# Altium schematic sheet Arria10.SchDoc: ALTERA ARRIA 10 Block Diagram
size C; DocumentNumber: 17; SheetNumber: 17; SheetTotal: 46
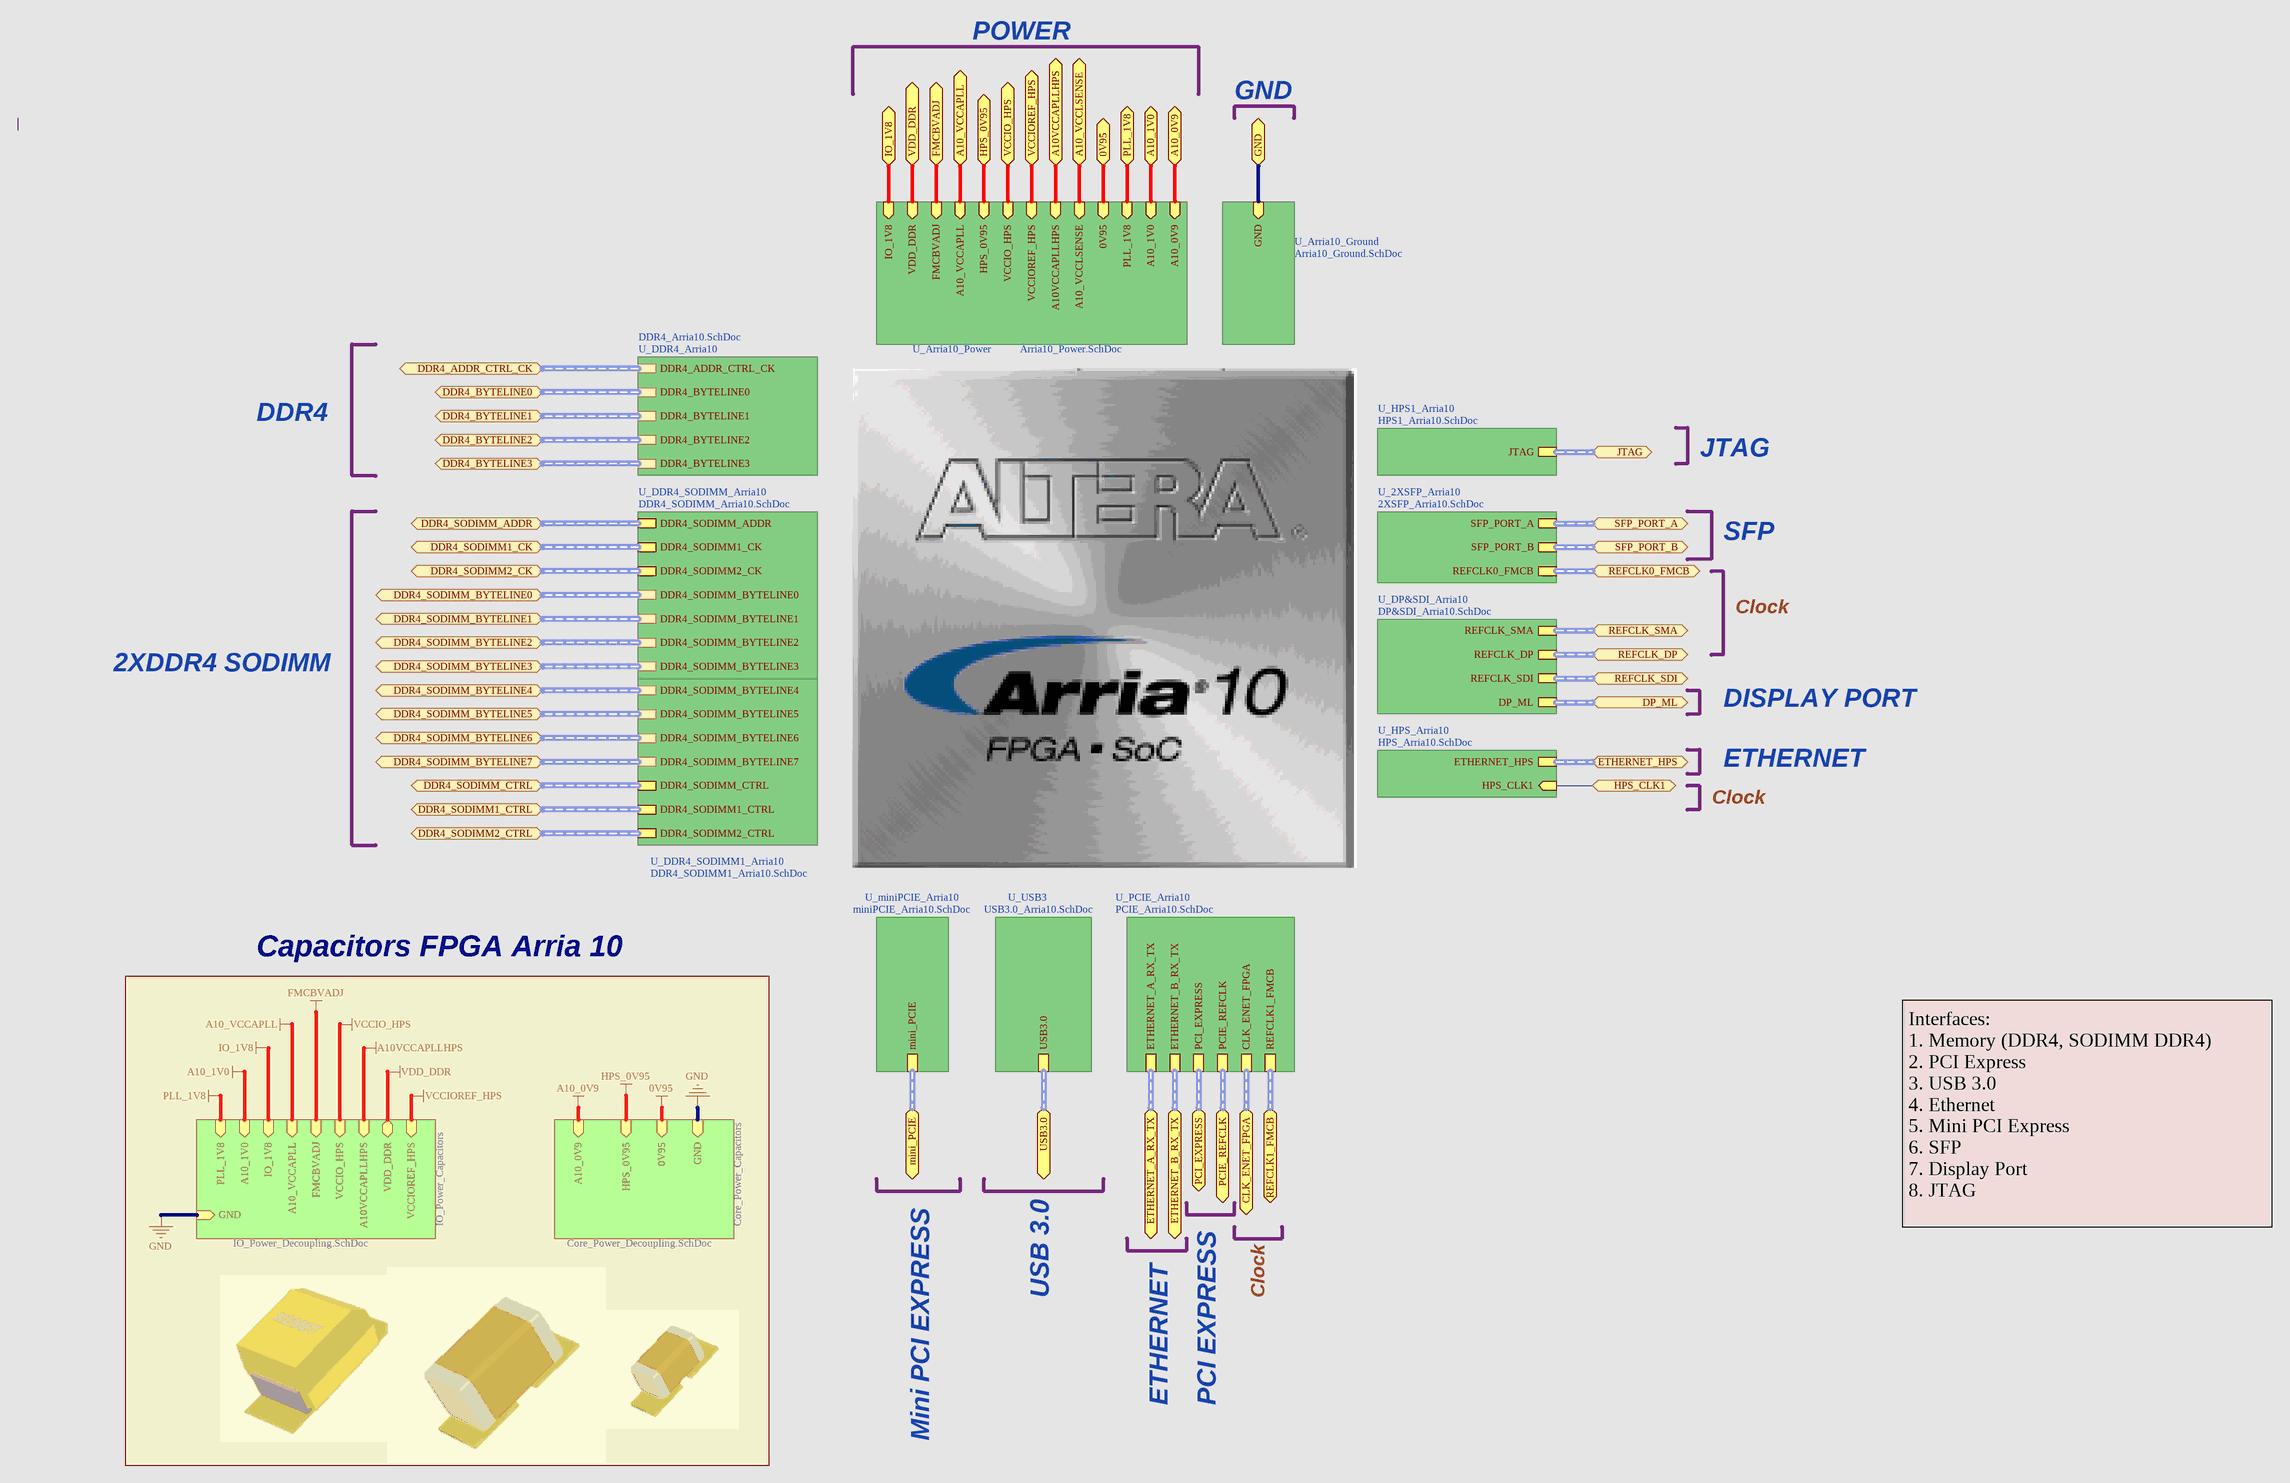
[diagram p0: Arria10.SchDoc]

## Sub-sheets
Core_Power_Capacitors = Core_Power_Decoupling.SchDoc: A10_0V9 (in), HPS_0V95 (in), 0V95 (in), GND (in)
IO_Power_Capacitors = IO_Power_Decoupling.SchDoc: PLL_1V8 (in), A10_1V0 (in), IO_1V8 (in), A10VCCAPLLHPS (in), VDD_DDR, VCCIOREF_HPS (in), A10_VCCAPLL (in), VCCIO_HPS (in), FMCBVADJ (in), GND (in)
U_2XSFP_Arria10 = 2XSFP_Arria10.SchDoc: REFCLK0_FMCB (harness REFCLK0_FMCB), SFP_PORT_B (harness SFP_PORT_B), SFP_PORT_A (harness SFP_PORT_A)
U_Arria10_Ground = Arria10_Ground.SchDoc: GND (in)
U_Arria10_Power = Arria10_Power.SchDoc: IO_1V8 (in), VDD_DDR (in), FMCBVADJ (in), A10_VCCAPLL (in), HPS_0V95 (in), VCCIO_HPS (in), VCCIOREF_HPS (in), A10VCCAPLLHPS (in), A10_VCCLSENSE (in), 0V95 (in), PLL_1V8 (in), A10_1V0 (in), A10_0V9 (in)
U_DDR4_Arria10 = DDR4_Arria10.SchDoc: DDR4_ADDR_CTRL_CK (harness DDR4_ADDR_CTRL_CK), DDR4_BYTELINE0 (harness DDR4_BYTELINE0), DDR4_BYTELINE1 (harness DDR4_BYTELINE1), DDR4_BYTELINE2 (harness DDR4_BYTELINE2), DDR4_BYTELINE3 (harness DDR4_BYTELINE3)
U_DDR4_SODIMM1_Arria10 = DDR4_SODIMM1_Arria10.SchDoc: DDR4_SODIMM1_CTRL (harness DDR4_SODIMM1_CTRL), DDR4_SODIMM2_CTRL (harness DDR4_SODIMM2_CTRL), DDR4_SODIMM_CTRL (harness DDR4_SODIMM_CTRL), DDR4_SODIMM_BYTELINE4 (harness DDR4_SODIMM_BYTELINE4), DDR4_SODIMM_BYTELINE5 (harness DDR4_SODIMM_BYTELINE5), DDR4_SODIMM_BYTELINE6 (harness DDR4_SODIMM_BYTELINE6), DDR4_SODIMM_BYTELINE7 (harness DDR4_SODIMM_BYTELINE7)
U_DDR4_SODIMM_Arria10 = DDR4_SODIMM_Arria10.SchDoc: DDR4_SODIMM_ADDR (harness DDR4_SODIMM_ADDR), DDR4_SODIMM1_CK (harness DDR4_SODIMM1_CK), DDR4_SODIMM2_CK (harness DDR4_SODIMM2_CK), DDR4_SODIMM_BYTELINE0 (harness DDR4_SODIMM_BYTELINE0), DDR4_SODIMM_BYTELINE1 (harness DDR4_SODIMM_BYTELINE1), DDR4_SODIMM_BYTELINE2 (harness DDR4_SODIMM_BYTELINE2), DDR4_SODIMM_BYTELINE3 (harness DDR4_SODIMM_BYTELINE3)
U_DP&SDI_Arria10 = DP&SDI_Arria10.SchDoc: REFCLK_SMA (harness REFCLK_SMA), REFCLK_DP (harness REFCLK_DP), REFCLK_SDI (harness REFCLK_SDI), DP_ML (harness DP_ML)
U_HPS1_Arria10 = HPS1_Arria10.SchDoc: JTAG (harness JTAG)
U_HPS_Arria10 = HPS_Arria10.SchDoc: HPS_CLK1 (in), ETHERNET_HPS (harness ETHERNET_HPS)
U_miniPCIE_Arria10 = miniPCIE_Arria10.SchDoc: mini_PCIE (harness mini_PCIE)
U_PCIE_Arria10 = PCIE_Arria10.SchDoc: ETHERNET_A_RX_TX (harness ETHERNET_A_RX_TX), ETHERNET_B_RX_TX (harness ETHERNET_B_RX_TX), PCI_EXPRESS (harness PCI_EXPRESS), CLK_ENET_FPGA (harness CLK_ENET), PCIE_REFCLK (harness REFCLK), REFCLK1_FMCB (harness REFCLK1_FMCB)
U_USB3 = USB3.0_Arria10.SchDoc: USB3.0 (harness USB3.0)

## Ports
0V95, A10_0V9, A10_1V0, A10_VCCAPLL, A10_VCCLSENSE, A10VCCAPLLHPS, CLK_ENET_FPGA, DDR4_ADDR_CTRL_CK, DDR4_BYTELINE0, DDR4_BYTELINE1, DDR4_BYTELINE2, DDR4_BYTELINE3, DDR4_SODIMM1_CK, DDR4_SODIMM1_CTRL, DDR4_SODIMM2_CK, DDR4_SODIMM2_CTRL, DDR4_SODIMM_ADDR, DDR4_SODIMM_BYTELINE0, DDR4_SODIMM_BYTELINE1, DDR4_SODIMM_BYTELINE2, DDR4_SODIMM_BYTELINE3, DDR4_SODIMM_BYTELINE4, DDR4_SODIMM_BYTELINE5, DDR4_SODIMM_BYTELINE6, DDR4_SODIMM_BYTELINE7, DDR4_SODIMM_CTRL, DP_ML, ETHERNET_A_RX_TX, ETHERNET_B_RX_TX, ETHERNET_HPS, FMCBVADJ, GND, HPS_0V95, HPS_CLK1, IO_1V8, JTAG, mini_PCIE, PCI_EXPRESS, PCIE_REFCLK, PLL_1V8, REFCLK0_FMCB, REFCLK1_FMCB, REFCLK_DP, REFCLK_SDI, REFCLK_SMA, SFP_PORT_A, SFP_PORT_B, USB3.0, VCCIO_HPS, VCCIOREF_HPS, VDD_DDR

## Nets
0V95: sheet Core_Power_Capacitors/0V95
A10_0V9: sheet Core_Power_Capacitors/A10_0V9
A10_1V0: sheet IO_Power_Capacitors/A10_1V0
A10_VCCAPLL: sheet IO_Power_Capacitors/A10_VCCAPLL
A10VCCAPLLHPS: sheet IO_Power_Capacitors/A10VCCAPLLHPS
FMCBVADJ: sheet IO_Power_Capacitors/FMCBVADJ
GND: sheet Core_Power_Capacitors/GND, sheet IO_Power_Capacitors/GND
HPS_0V95: sheet Core_Power_Capacitors/HPS_0V95
IO_1V8: sheet IO_Power_Capacitors/IO_1V8
PLL_1V8: sheet IO_Power_Capacitors/PLL_1V8
VCCIO_HPS: sheet IO_Power_Capacitors/VCCIO_HPS
VCCIOREF_HPS: sheet IO_Power_Capacitors/VCCIOREF_HPS
VDD_DDR: sheet IO_Power_Capacitors/VDD_DDR
0V95: port 0V95, sheet U_Arria10_Power/0V95  [a separate net that carries the same name]
A10_0V9: port A10_0V9, sheet U_Arria10_Power/A10_0V9  [a separate net that carries the same name]
A10_1V0: port A10_1V0, sheet U_Arria10_Power/A10_1V0  [a separate net that carries the same name]
A10_VCCAPLL: port A10_VCCAPLL, sheet U_Arria10_Power/A10_VCCAPLL  [a separate net that carries the same name]
A10_VCCLSENSE: port A10_VCCLSENSE, sheet U_Arria10_Power/A10_VCCLSENSE
A10VCCAPLLHPS: port A10VCCAPLLHPS, sheet U_Arria10_Power/A10VCCAPLLHPS  [a separate net that carries the same name]
FMCBVADJ: port FMCBVADJ, sheet U_Arria10_Power/FMCBVADJ  [a separate net that carries the same name]
GND: port GND, sheet U_Arria10_Ground/GND  [a separate net that carries the same name]
HPS_0V95: port HPS_0V95, sheet U_Arria10_Power/HPS_0V95  [a separate net that carries the same name]
HPS_CLK1: port HPS_CLK1, sheet U_HPS_Arria10/HPS_CLK1
IO_1V8: port IO_1V8, sheet U_Arria10_Power/IO_1V8  [a separate net that carries the same name]
PLL_1V8: port PLL_1V8, sheet U_Arria10_Power/PLL_1V8  [a separate net that carries the same name]
VCCIO_HPS: port VCCIO_HPS, sheet U_Arria10_Power/VCCIO_HPS  [a separate net that carries the same name]
VCCIOREF_HPS: port VCCIOREF_HPS, sheet U_Arria10_Power/VCCIOREF_HPS  [a separate net that carries the same name]
VDD_DDR: port VDD_DDR, sheet U_Arria10_Power/VDD_DDR  [a separate net that carries the same name]

## Buses and harness runs
harness port CLK_ENET_FPGA = sheet U_PCIE_Arria10/CLK_ENET_FPGA
harness port DDR4_ADDR_CTRL_CK = sheet U_DDR4_Arria10/DDR4_ADDR_CTRL_CK
harness port DDR4_BYTELINE0 = sheet U_DDR4_Arria10/DDR4_BYTELINE0
harness port DDR4_BYTELINE1 = sheet U_DDR4_Arria10/DDR4_BYTELINE1
harness port DDR4_BYTELINE2 = sheet U_DDR4_Arria10/DDR4_BYTELINE2
harness port DDR4_BYTELINE3 = sheet U_DDR4_Arria10/DDR4_BYTELINE3
harness port DDR4_SODIMM1_CK = sheet U_DDR4_SODIMM_Arria10/DDR4_SODIMM1_CK
harness port DDR4_SODIMM1_CTRL = sheet U_DDR4_SODIMM1_Arria10/DDR4_SODIMM1_CTRL
harness port DDR4_SODIMM2_CK = sheet U_DDR4_SODIMM_Arria10/DDR4_SODIMM2_CK
harness port DDR4_SODIMM2_CTRL = sheet U_DDR4_SODIMM1_Arria10/DDR4_SODIMM2_CTRL
harness port DDR4_SODIMM_ADDR = sheet U_DDR4_SODIMM_Arria10/DDR4_SODIMM_ADDR
harness port DDR4_SODIMM_BYTELINE0 = sheet U_DDR4_SODIMM_Arria10/DDR4_SODIMM_BYTELINE0
harness port DDR4_SODIMM_BYTELINE1 = sheet U_DDR4_SODIMM_Arria10/DDR4_SODIMM_BYTELINE1
harness port DDR4_SODIMM_BYTELINE2 = sheet U_DDR4_SODIMM_Arria10/DDR4_SODIMM_BYTELINE2
harness port DDR4_SODIMM_BYTELINE3 = sheet U_DDR4_SODIMM_Arria10/DDR4_SODIMM_BYTELINE3
harness port DDR4_SODIMM_BYTELINE4 = sheet U_DDR4_SODIMM1_Arria10/DDR4_SODIMM_BYTELINE4
harness port DDR4_SODIMM_BYTELINE5 = sheet U_DDR4_SODIMM1_Arria10/DDR4_SODIMM_BYTELINE5
harness port DDR4_SODIMM_BYTELINE6 = sheet U_DDR4_SODIMM1_Arria10/DDR4_SODIMM_BYTELINE6
harness port DDR4_SODIMM_BYTELINE7 = sheet U_DDR4_SODIMM1_Arria10/DDR4_SODIMM_BYTELINE7
harness port DDR4_SODIMM_CTRL = sheet U_DDR4_SODIMM1_Arria10/DDR4_SODIMM_CTRL
harness port DP_ML = sheet U_DP&SDI_Arria10/DP_ML
harness port ETHERNET_A_RX_TX = sheet U_PCIE_Arria10/ETHERNET_A_RX_TX
harness port ETHERNET_B_RX_TX = sheet U_PCIE_Arria10/ETHERNET_B_RX_TX
harness port ETHERNET_HPS = sheet U_HPS_Arria10/ETHERNET_HPS
harness port JTAG = sheet U_HPS1_Arria10/JTAG
harness port mini_PCIE = sheet U_miniPCIE_Arria10/mini_PCIE
harness port PCI_EXPRESS = sheet U_PCIE_Arria10/PCI_EXPRESS
harness port PCIE_REFCLK = sheet U_PCIE_Arria10/PCIE_REFCLK
harness port REFCLK0_FMCB = sheet U_2XSFP_Arria10/REFCLK0_FMCB
harness port REFCLK1_FMCB = sheet U_PCIE_Arria10/REFCLK1_FMCB
harness port REFCLK_DP = sheet U_DP&SDI_Arria10/REFCLK_DP
harness port REFCLK_SDI = sheet U_DP&SDI_Arria10/REFCLK_SDI
harness port REFCLK_SMA = sheet U_DP&SDI_Arria10/REFCLK_SMA
harness port SFP_PORT_A = sheet U_2XSFP_Arria10/SFP_PORT_A
harness port SFP_PORT_B = sheet U_2XSFP_Arria10/SFP_PORT_B
harness port USB3.0 = sheet U_USB3/USB3.0

## Notes on the sheet
- POWER
- GND
- DDR4
- JTAG
- SFP
- Clock
- 2XDDR4 SODIMM
- DISPLAY PORT
- ETHERNET
- Capacitors FPGA Arria 10
- Interfaces:
  1. Memory (DDR4, SODIMM DDR4)
  2. PCI Express
  3. USB 3.0
  4. Ethernet
  5. Mini PCI Express
  6. SFP
  7. Display Port
  8. JTAG
- USB 3.0
- PCI EXPRESS
- Mini PCI EXPRESS
- Title
- Size:
- Date:
- File:
- C
- Number:
- Time:
- Revision:
- Sheet
- of